# Altium schematic sheet BMS_Voltage.SchDoc
size A4; Organization: Altium Limited; Address1: L3, 12a Rodborough Rd; Address2: Frenchs Forest; Address3: NSW; Address4: Australia 2086; SheetNumber: 5
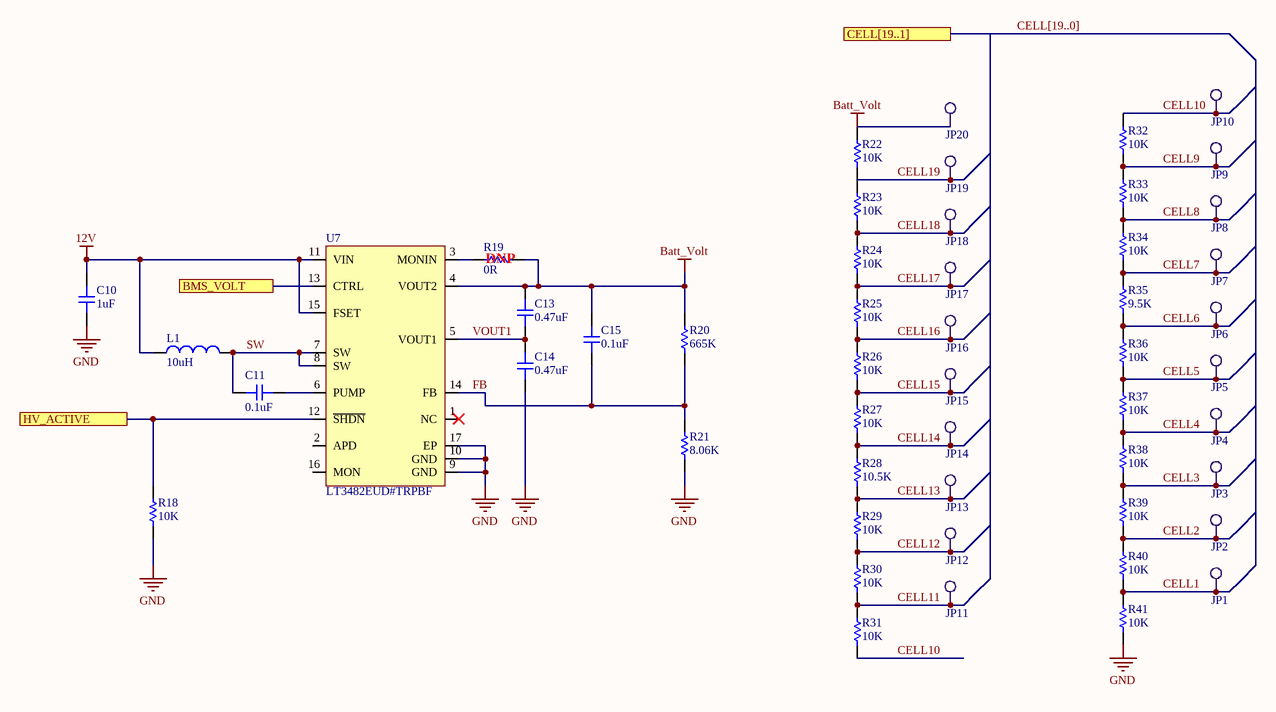
[diagram p0: BMS_Voltage.SchDoc]

## Parts
C10  1uF  [CAP-0603]
C11  0.1uF  [CAP-1206]
C13  0.47uF  [CAP-0805]
C14  0.47uF  [CAP-0805]
C15  0.1uF  [CAP-1206]
JP1  Testpoint2  [TP2]  (value not drawn)
JP2  Testpoint2  [TP2]  (value not drawn)
JP3  Testpoint2  [TP2]  (value not drawn)
JP4  Testpoint2  [TP2]  (value not drawn)
JP5  Testpoint2  [TP2]  (value not drawn)
JP6  Testpoint2  [TP2]  (value not drawn)
JP7  Testpoint2  [TP2]  (value not drawn)
JP8  Testpoint2  [TP2]  (value not drawn)
JP9  Testpoint2  [TP2]  (value not drawn)
JP10  Testpoint2  [TP2]  (value not drawn)
JP11  Testpoint2  [TP2]  (value not drawn)
JP12  Testpoint2  [TP2]  (value not drawn)
JP13  Testpoint2  [TP2]  (value not drawn)
JP14  Testpoint2  [TP2]  (value not drawn)
JP15  Testpoint2  [TP2]  (value not drawn)
JP16  Testpoint2  [TP2]  (value not drawn)
JP17  Testpoint2  [TP2]  (value not drawn)
JP18  Testpoint2  [TP2]  (value not drawn)
JP19  Testpoint2  [TP2]  (value not drawn)
JP20  Testpoint2  [TP2]  (value not drawn)
L1  10uH  [IND-3.2x2.5x2.2]
R18  10K  [RES-0603]
R19  0R  [RES-0603]
R20  665K  [RES-0603]
R21  8.06K  [RES-0603]
R22  10K  [RES-0603]
R23  10K  [RES-0603]
R24  10K  [RES-0603]
R25  10K  [RES-0603]
R26  10K  [RES-0603]
R27  10K  [RES-0603]
R28  10.5K  [RES-0603]
R29  10K  [RES-0603]
R30  10K  [RES-0603]
R31  10K  [RES-0603]
R32  10K  [RES-0603]
R33  10K  [RES-0603]
R34  10K  [RES-0603]
R35  9.5K  [RES-0603]
R36  10K  [RES-0603]
R37  10K  [RES-0603]
R38  10K  [RES-0603]
R39  10K  [RES-0603]
R40  10K  [RES-0603]
R41  10K  [RES-0603]
U7  LT3482EUD#TRPBF  [QFN-16 (3x3mm)]

## Ports
BMS_VOLT, CELL[19..1], HV_ACTIVE

## Nets
12V: C10.2 L1.1 U7.11(VIN) U7.15(FSET)
Batt_Volt: C13.2 C15.2 JP20.1 R19.2 R20.2 R22.2 U7.4(VOUT2)
GND: C10.1 C14.1 R18.1 R21.1 R41.1 U7.9(GND) U7.10(GND) U7.17(EP)
BMS_VOLT: U7.13(CTRL) ; port BMS_VOLT
CELL1: JP1.1 R40.1 R41.2
CELL2: JP2.1 R39.1 R40.2
CELL3: JP3.1 R38.1 R39.2
CELL4: JP4.1 R37.1 R38.2
CELL5: JP5.1 R36.1 R37.2
CELL6: JP6.1 R35.1 R36.2
CELL7: JP7.1 R34.1 R35.2
CELL8: JP8.1 R33.1 R34.2
CELL9: JP9.1 R32.1 R33.2
CELL10: JP10.1 R31.1 R32.2
CELL11: JP11.1 R30.1 R31.2
CELL12: JP12.1 R29.1 R30.2
CELL13: JP13.1 R28.1 R29.2
CELL14: JP14.1 R27.1 R28.2
CELL15: JP15.1 R26.1 R27.2
CELL16: JP16.1 R25.1 R26.2
CELL17: JP17.1 R24.1 R25.2
CELL18: JP18.1 R23.1 R24.2
CELL19: JP19.1 R22.1 R23.2
FB: C15.1 R20.1 R21.2 U7.14(FB)
HV_ACTIVE: R18.2 U7.12(~{SHDN}) ; port HV_ACTIVE
SW: C11.2 L1.2 U7.7(SW) U7.8(SW)
VOUT1: C13.1 C14.2 U7.5(VOUT1)
NetC11_1: C11.1 U7.6(PUMP)
NetR19_1: R19.1 U7.3(MONIN)

Not connected (* = marked no-connect by the designer): U7 1(NC)* 2(APD) 16(MON)

## Buses and harness runs
bus CELL[19..0] = port CELL[19..1]

## Notes on the sheet
- (near R19) DNP
- Title
- Size:
- Date:
- Tabloid
- Number:
- Time:
- Revision:
- Sheet
- of
- File:

## Library data of the parts
C10 = 0603-1uF-16V: CAP CER 1UF 16V X7R 0603; Manufacturer: KEMET; Manufacturer Part Number: C0603C105K4RACTU; Dielectric Material: Ceramic; Tolerance: 10%; Dissipation Factor: 3.5%; Supplier 1: Digi-Key; Stock 1: 600463; Pricing 1: 1=0.12, 10=0.088, 100=0.0391, 500=0.02792, 1000=0.02193 (USD); Mount: Surface Mount,PCB; Case/Package: 0603; Number of Pins: 2; Case Code (Metric): 1608; Case Code (Imperial): 0603; Contact Plating: Tin,Matte; Min Operating Temperature: -55°C; Max Operating Temperature: 125°C; Package Quantity: 4000; Capacitance: 1uF; Voltage Rating: 16V; Packaging: Tape and Reel; Voltage Rating (DC): 16V; Dielectric: X7R; Termination: SMD/SMT; Voltage: 16V; Length: 1.6mm; Height: 0.8mm; Width: 0.031inch; Thickness: 0.034inch; Depth: 0.8mm; Radiation Hardening: No; REACH SVHC: No SVHC; ComponentLink1URL: http://www.mouser.com/ds/2/212/KEM_C1002_X7R_SMD-1102033.pdf?src-supplier=Mouser; ComponentLink1Description: http://www.mouser.com/ds/2/212/KEM_C1002_X7R_SMD-1102033.pdf?src-supplier=Mouser; ComponentLink2URL: http://www.kemet.com/kemet/web/homepage/kechome.nsf/file/Commercial%20Ceramic%20Chips%20X7R%20Dielectric/$file/KEM_C1002_X7R_SMD.pdf?src-supplier=Element14; ComponentLink2Description: http://www.kemet.com/kemet/web/homepage/kechome.nsf/file/Commercial%20Ceramic%20Chips%20X7R%20Dielectric/$file/KEM_C1002_X7R_SMD.pdf?src-supplier=Element14; ComponentLink3URL: https://www.verical.com/server-webapp/html/getDatasheet?partID=385479&src-supplier=Verical; ComponentLink3Description: https://www.verical.com/server-webapp/html/getDatasheet?partID=385479&src-supplier=Verical; ComponentLink4URL: http://www.kemet.com/kemet/web/homepage/kechome.nsf/vapubfiles/KEM_C1002_X7R_SMD.pdf/$file/KEM_C1002_X7R_SMD.pdf?src-supplier=Element14; ComponentLink4Description: http://www.kemet.com/kemet/web/homepage/kechome.nsf/vapubfiles/KEM_C1002_X7R_SMD.pdf/$file/KEM_C1002_X7R_SMD.pdf?src-supplier=Element14; Supplier Part Number 1: 399-7847-6-ND
C11 C15 = 1206-0.1uF-100V: CAP CER 0.1UF 100V X7R 1206; Manufacturer: KEMET; Manufacturer Part Number: C1206C104K1RACTU; Dielectric Material: Ceramic; Capacitance: 100nF; Tolerance: 10%; Supplier 1: Digi-Key; Stock 1: 407754; Pricing 1: 1=0.28, 10=0.19, 100=0.1075, 500=0.0759, 1000=0.06641 (USD); Mount: Surface Mount,PCB; Case/Package: 1206; Number of Pins: 2; Case Code (Imperial): 1206; Case Code (Metric): 3216; Contact Plating: Tin,Matte; Min Operating Temperature: -55°C; Max Operating Temperature: 125°C; Packaging: Tape and Reel; Package Quantity: 1; Voltage Rating: 100V; Voltage Rating (DC): 100V; Dielectric: X7R; Termination: SMD/SMT; Voltage: 100V; Length: 3.2mm; Height: 0.78mm; Width: 1.6mm; Thickness: 0.035inch; Depth: 1.6mm; Radiation Hardening: No; REACH SVHC: No SVHC; ComponentLink1URL: http://www.farnell.com/datasheets/2740715.pdf?src-supplier=Element14; ComponentLink1Description: http://www.farnell.com/datasheets/2740715.pdf?src-supplier=Element14; ComponentLink2URL: https://search.kemet.com/component-edge/download/datasheet/C1206C104K1RACTU.pdf?src-supplier=Allied+Electronics; ComponentLink2Description: https://search.kemet.com/component-edge/download/datasheet/C1206C104K1RACTU.pdf?src-supplier=Allied+Electronics; Supplier Part Number 1: 399-1805-6-ND
C13 C14 = 0805-0.47uF-100V: CAP CER 0.47UF 100V X7S 0805; Manufacturer: TDK; Manufacturer Part Number: C2012X7S2A474M125AB; Tolerance: 20%; Capacitance: 470nF; Supplier 1: Digi-Key; Stock 1: 8557; Pricing 1: 1=0.44, 10=0.303, 50=0.2118, 100=0.1815, 500=0.13612, 1000=0.11495 (USD); Mount: Surface Mount; Case/Package: 0805; Number of Pins: 2; Case Code (Metric): 2012; Case Code (Imperial): 0805; Weight: 0.000194oz; Min Operating Temperature: -55°C; Max Operating Temperature: 125°C; Voltage Rating (DC): 100V; Packaging: Tape and Reel; Package Quantity: 1; Voltage Rating: 100V; Dielectric: X7S; Termination: SMD/SMT; Resistor Type: Ceramic; Length: 2mm; Width: 0.049inch; Thickness: 0.057inch; Depth: 1.25mm; ComponentLink1URL: http://www.mouser.com/ds/2/400/lcc_commercial_general_en-837201.pdf?src-supplier=Mouser; ComponentLink1Description: http://www.mouser.com/ds/2/400/lcc_commercial_general_en-837201.pdf?src-supplier=Mouser; Supplier Part Number 1: 445-5204-6-ND
JP1-JP20 = Testpoint2: Single layer pad TP
L1 = 10uH-0.6A: FIXED IND 10UH 600MA 504 MOHM; Manufacturer: TDK; Manufacturer Part Number: NLCV32T-100K-EFRD; Core Material: Ferrite; Shielding: Unshielded; DC Resistance (DCR): 504mR; Self Resonant Frequency: 30MHz; Test Frequency: 2.52MHz; Tolerance: 10%; Supplier 1: Digi-Key; Stock 1: 3400; Pricing 1: 1=0.3, 10=0.264, 25=0.2312, 50=0.198, 100=0.1815, 250=0.165, 500=0.1551, 1000=0.1188 (USD); Mount: Surface Mount; Case/Package: 1210; Min Operating Temperature: -40°C; Max Operating Temperature: 125°C; Packaging: Tape and Reel; Resistor Type: Wirewound; Inductance: 10uH; Current Rating: 600mA; Length: 0.126inch; Width: 0.098inch; Height - Seated (Max): 0.094inch; Ratings: AEC-Q200; ComponentLink1URL: https://product.tdk.com/info/en/catalog/datasheets/inductor_automotive_decoupling_nlcv32-efrd_en.pdf?src-supplier=Digi-Key; ComponentLink1Description: https://product.tdk.com/info/en/catalog/datasheets/inductor_automotive_decoupling_nlcv32-efrd_en.pdf?src-supplier=Digi-Key; ComponentLink2URL: http://www.farnell.com/datasheets/2261959.pdf?src-supplier=Farnell; ComponentLink2Description: http://www.farnell.com/datasheets/2261959.pdf?src-supplier=Farnell; Supplier Part Number 1: 445-175563-6-ND
R18 R22-R27 R29-R34 R36-R41 = 0603-10KR: RES SMD 10K OHM 5% 1/10W 0603; Manufacturer: Yageo; Manufacturer Part Number: RC0603JR-0710KL; Resistance: 10kR; Voltage Rating (DC): 50V; Temperature Coefficient: 100ppm/°C; Power Rating: 100mW; Supplier 1: Digi-Key; Stock 1: 3006558; Pricing 1: 1=0.1, 10=0.019, 100=0.0077, 1000=0.00347, 2500=0.00301 (USD); Case/Package: 0603; Number of Pins: 2; Contact Plating: Tin,Matte; Case Code (Imperial): 0603; Case Code (Metric): 1608; Min Operating Temperature: -55°C; Max Operating Temperature: 155°C; Packaging: Tape and Reel; Tolerance: 5%; Composition: Thick Film; Voltage Rating: 50V; Termination: SMD/SMT; Military Standard: Not; Features: Moisture Resistant; Max Power Dissipation: 100mW; Number of Terminations: 2; Length: 0.063inch; Width: 0.031inch; Depth: 0.8mm; Height - Seated (Max): 0.022inch; Radiation Hardening: No; REACH SVHC: Unknown; Lead Free: Lead Free; ComponentLink1URL: http://www.yageo.com/documents/recent/PYu-RC_Group_51_RoHS_L_10.pdf?src-supplier=Digi-Key; ComponentLink1Description: http://www.yageo.com/documents/recent/PYu-RC_Group_51_RoHS_L_10.pdf?src-supplier=Digi-Key; Supplier Part Number 1: 311-10KGRDKR-ND
R19 = 0603-0R: RES SMD 0 OHM JUMPER 1/10W 0603; Manufacturer: Yageo; Manufacturer Part Number: RC0603JR-070RL; Resistance: 0mR; Tolerance: 1%; Voltage Rating: 50V; Power Rating: 100mW; Temperature Coefficient: 200ppm/°C; Supplier 1: Digi-Key; Stock 1: 25658294; Pricing 1: 1=0.1, 10=0.019, 25=0.0136, 50=0.0104, 100=0.0077, 250=0.00588, 500=0.00472, 1000=0.00347 (USD); Case/Package: 0603; Number of Pins: 2; Case Code (Imperial): 0603; Case Code (Metric): 1608; Contact Plating: Tin,Matte; Min Operating Temperature: -55°C; Max Operating Temperature: 155°C; Package Quantity: 5000; Packaging: Tape and Reel; Voltage Rating (DC): 50V; Termination: SMD/SMT; Composition: Thick Film; Military Standard: Not; Length: 1.6mm; Height: 0.45mm; Width: 0.8mm; Depth: 0.8mm; Radiation Hardening: No; REACH SVHC: No SVHC; Lead Free: Lead Free; ComponentLink1URL: http://www.farnell.com/datasheets/2167052.pdf?src-supplier=Element14; ComponentLink1Description: http://www.farnell.com/datasheets/2167052.pdf?src-supplier=Element14; ComponentLink2URL: https://www.verical.com/server-webapp/html/getDatasheet?partID=329462&src-supplier=Verical; ComponentLink2Description: https://www.verical.com/server-webapp/html/getDatasheet?partID=329462&src-supplier=Verical; ComponentLink3URL: http://www.yageo.com/documents/recent/PYu-RC_Group_51_RoHS_L_9.pdf?src-supplier=Mouser; ComponentLink3Description: http://www.yageo.com/documents/recent/PYu-RC_Group_51_RoHS_L_9.pdf?src-supplier=Mouser; ComponentLink4URL: http://www.farnell.com/datasheets/443971.pdf?src-supplier=Element14; ComponentLink4Description: http://www.farnell.com/datasheets/443971.pdf?src-supplier=Element14; ComponentLink5URL: http://documents.rs-components.com/techlib://itc_doclist_GB.htm?stockno=6515918&src-supplier=RSComponents; ComponentLink5Description: http://documents.rs-components.com/techlib://itc_doclist_GB.htm?stockno=6515918&src-supplier=RSComponents; Supplier Part Number 1: 311-0.0GRCT-ND
R20 = 0603-665KR: RES 665K OHM 1% 1/10W 0603; Manufacturer: Stackpole Electronics; Manufacturer Part Number: RMCF0603FT665K; Resistance: 665kR; Power Rating: 100mW; Temperature Coefficient: 100ppm/°C; Supplier 1: Digi-Key; Stock 1: 14804; Pricing 1: 1=0.1, 10=0.015, 100=0.0059, 1000=0.00265, 2500=0.0023 (USD); Mount: Surface Mount; Case/Package: 0603; Case Code (Metric): 1608; Case Code (Imperial): 0603; Contact Plating: Tin,Matte; Min Operating Temperature: -55°C; Max Operating Temperature: 155°C; Tolerance: 1%; Packaging: Tape and Reel; Resistor Type: Thick Film; Number of Terminations: 2; Max Power Dissipation: 100mW; Features: Automotive AEC-Q200; Length: 0.061inch; Width: 0.031inch; Height: 0.022inch; Radiation Hardening: No; Lead Free: Lead Free; ComponentLink1URL: https://www.seielect.com/Catalog/SEI-RMCF_RMCP.pdf?src-supplier=Digi-Key; ComponentLink1Description: https://www.seielect.com/Catalog/SEI-RMCF_RMCP.pdf?src-supplier=Digi-Key; ComponentLink2URL: http://www.seielect.com/Catalog/SEI-RMC.pdf?src-supplier=Future+Electronics; ComponentLink2Description: http://www.seielect.com/Catalog/SEI-RMC.pdf?src-supplier=Future+Electronics; ComponentLink3URL: https://www.seielect.com/catalog/SEI-RMCF_RMCP.pdf?src-supplier=Avnet; ComponentLink3Description: https://www.seielect.com/catalog/SEI-RMCF_RMCP.pdf?src-supplier=Avnet; Supplier Part Number 1: RMCF0603FT665KDKR-ND
R21 = 0603-8.06KR: RES SMD 8.06K OHM 1% 1/10W 0603; Manufacturer: Panasonic; Manufacturer Part Number: ERJ-3EKF8061V; Voltage Rating: 75V; Resistance: 8.06kR; Power Rating: 100mW; Temperature Coefficient: 100ppm/°C; Voltage Rating (DC): 50V; Supplier 1: Digi-Key; Stock 1: 296308; Pricing 1: 1=0.1, 10=0.032, 100=0.013, 1000=0.00583, 2500=0.00506 (USD); Mount: Surface Mount; Case/Package: 0603; Case Code (Imperial): 0603; Case Code (Metric): 1608; Contact Plating: Tin; Min Operating Temperature: -55°C; Max Operating Temperature: 155°C; Packaging: Tape and Reel; Tolerance: 1%; Package Quantity: 1; Termination: SMD/SMT; Resistor Type: Thick Film; Number of Terminations: 2; Max Power Dissipation: 100mW; Features: Automotive AEC-Q200; Length: 1.6mm; Width: 0.8mm; Height: 0.022inch; Depth: 0.8mm; Radiation Hardening: No; REACH SVHC: Unknown; Military Standard: Not; Lead Free: Lead Free; ComponentLink1URL: http://industrial.panasonic.com/www-data/pdf/AOA0000/AOA0000CE2.pdf?src-supplier=Avnet; ComponentLink1Description: http://industrial.panasonic.com/www-data/pdf/AOA0000/AOA0000CE2.pdf?src-supplier=Avnet; ComponentLink2URL: https://www.alliedelec.com/m/d/623f45ff1957d936ff56d46fd1c28cac.pdf?src-supplier=Allied+Electronics; ComponentLink2Description: https://www.alliedelec.com/m/d/623f45ff1957d936ff56d46fd1c28cac.pdf?src-supplier=Allied+Electronics; ComponentLink3URL: http://www.farnell.com/datasheets/1678782.pdf?src-supplier=Element14; ComponentLink3Description: http://www.farnell.com/datasheets/1678782.pdf?src-supplier=Element14; ComponentLink4URL: http://www.farnell.com/datasheets/1911175.pdf?src-supplier=Element14; ComponentLink4Description: http://www.farnell.com/datasheets/1911175.pdf?src-supplier=Element14; ComponentLink5URL: http://industrial.panasonic.com/www-data/pdf/AOA0000/AOA0000CE2.pdf?src-supplier=Avnet+Europe; ComponentLink5Description: http://industrial.panasonic.com/www-data/pdf/AOA0000/AOA0000CE2.pdf?src-supplier=Avnet+Europe; ComponentLink6URL: http://www.farnell.com/datasheets/1911175.pdf?src-supplier=Farnell; ComponentLink6Description: http://www.farnell.com/datasheets/1911175.pdf?src-supplier=Farnell; Supplier Part Number 1: P8.06KHDKR-ND
R28 = 0603-10.5KR: RES SMD 10.5KOHM 0.5% 1/10W 0603; Manufacturer: Yageo; Manufacturer Part Number: RT0603DRE0710K5L; Resistance: 10.5kR; Max Power Dissipation: 100mW; Temperature Coefficient: 50ppm/°C; Voltage Rating (DC): 50V; Supplier 1: Digi-Key; Stock 1: 24502; Pricing 1: 1=0.1, 10=0.092, 100=0.0356, 1000=0.01564, 2500=0.01351 (USD); Case/Package: 0603; Case Code (Metric): 1608; Case Code (Imperial): 0603; Min Operating Temperature: -55°C; Max Operating Temperature: 155°C; Package Quantity: 5000; Packaging: Tape and Reel; Tolerance: 0.5%; Resistor Type: Thin Film; Number of Terminations: 2; Features: Moisture Resistant; Length: 0.063inch; Height: 0.022inch; Width: 0.031inch; Lead Free: Lead Free; ComponentLink1URL: http://www.yageo.com/NewPortal/yageodocoutput?fileName=/pdf/R-Chip/PYu-RT_1-to-0.05_RoHS_L_5.pdf&src-supplier=Digi-Key; ComponentLink1Description: http://www.yageo.com/NewPortal/yageodocoutput?fileName=/pdf/R-Chip/PYu-RT_1-to-0.05_RoHS_L_5.pdf&src-supplier=Digi-Key; Supplier Part Number 1: 311-2399-6-ND
R35 = 0603-9.5KR: RES SMD 9.53K OHM 1% 1/10W 0603; Manufacturer: Yageo; Manufacturer Part Number: RC0603FR-0795K3L; Resistance: 95.3kR; Voltage Rating (DC): 50V; Power Rating: 100mW; Temperature Coefficient: 100ppm/°C; Working Voltage: 75V; Supplier 1: Digi-Key; Stock 1: 131701; Pricing 1: 1=0.1, 10=0.021, 100=0.0085, 1000=0.00382, 2500=0.00331 (USD); Case/Package: 0603; Case Code (Imperial): 0603; Case Code (Metric): 1608; Min Operating Temperature: -55°C; Max Operating Temperature: 155°C; Tolerance: 1%; Packaging: Tape and Reel; Voltage Rating: 50V; Package Quantity: 5000; Termination: SMD/SMT; Resistor Type: Thick Film; Features: Moisture Resistant; Number of Terminations: 2; Max Power Dissipation: 100mW; Length: 0.063inch; Height: 0.022inch; Width: 0.031inch; Depth: 0.8mm; Lead Free: Lead Free; Military Standard: Not; Supplier Part Number 1: 311-95.3KHRDKR-ND
U7 = Boost Adj-280mA: IC REG BOOST ADJ 280MA 16QFN; Manufacturer: Analog Devices / Linear Technology; Output Voltage: 90V; Min Input Voltage: 2.5V; Number of Outputs: 1; Switching Frequency: 1.1MHz; Synchronous Rectifier: No; Output Type: Adjustable; Supplier 1: Digi-Key; Manufacturer Part Number: LT3482EUD#TRPBF; Stock 1: 2233; Pricing 1: 1=8.73, 25=4.8284 (USD); Case/Package: QFN EP; Number of Pins: 16; Min Operating Temperature: -40°C; Max Operating Temperature: 85°C; Output Current: 280mA; Package Quantity: 2500; Packaging: Tape and Reel; Lead Free: Lead Free; ComponentLink1URL: http://www.linear.com/docs/18598?src-supplier=Digi-Key; ComponentLink1Description: http://www.linear.com/docs/18598?src-supplier=Digi-Key; ComponentLink2URL: http://datasheet.iiic.cc/linear_technology/LT3482EUD_TRPBF.pdf?src-supplier=IIIC; ComponentLink2Description: http://datasheet.iiic.cc/linear_technology/LT3482EUD_TRPBF.pdf?src-supplier=IIIC; Supplier Part Number 1: LT3482EUD#TRPBFDKR-ND